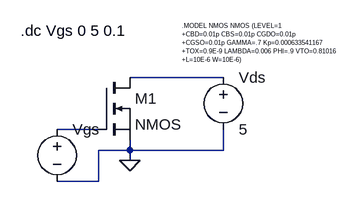
[diagram p0: schematic first.asc]
first.asc, the LTspice schematic file:
Version 4
SHEET 1 900 680
WIRE 352 144 208 144
WIRE 160 224 96 224
WIRE 208 256 208 240
WIRE 208 256 160 256
WIRE 352 256 352 224
WIRE 352 256 208 256
WIRE 208 272 208 256
WIRE 160 304 160 256
WIRE 160 304 96 304
FLAG 208 272 0
SYMBOL nmos 160 144 R0
SYMATTR InstName M1
SYMBOL voltage 96 208 R0
SYMATTR InstName Vgs
SYMATTR Value ""
SYMBOL voltage 352 128 R0
WINDOW 123 0 0 Left 0
WINDOW 39 0 0 Left 0
SYMATTR InstName Vds
SYMATTR Value 5
TEXT 288 64 Left 0 !.MODEL NMOS NMOS (LEVEL=1 \n+CBD=0.01p CBS=0.01p CGDO=0.01p \n+CGSO=0.01p GAMMA=.7 Kp=0.000633541167\n+TOX=0.9E-9 LAMBDA=0.006 PHI=.9 VTO=0.81016\n+L=10E-6 W=10E-6)
TEXT 40 72 Left 2 !.dc Vgs 0 5 0.1

The netlist it stands for:
* first.asc
M1 N001 N002 0 0 NMOS
Vgs N002 0
Vds N001 0 5
.model NMOS NMOS
.model PMOS PMOS
.lib standard.mos
.MODEL NMOS NMOS (LEVEL=1
+CBD=0.01p CBS=0.01p CGDO=0.01p
+CGSO=0.01p GAMMA=.7 Kp=0.000633541167
+TOX=0.9E-9 LAMBDA=0.006 PHI=.9 VTO=0.81016
+L=10E-6 W=10E-6)
.dc Vgs 0 5 0.1
.backanno
.end